# Altium schematic sheet Sheet1.SchDoc
size 406 x 254 mm
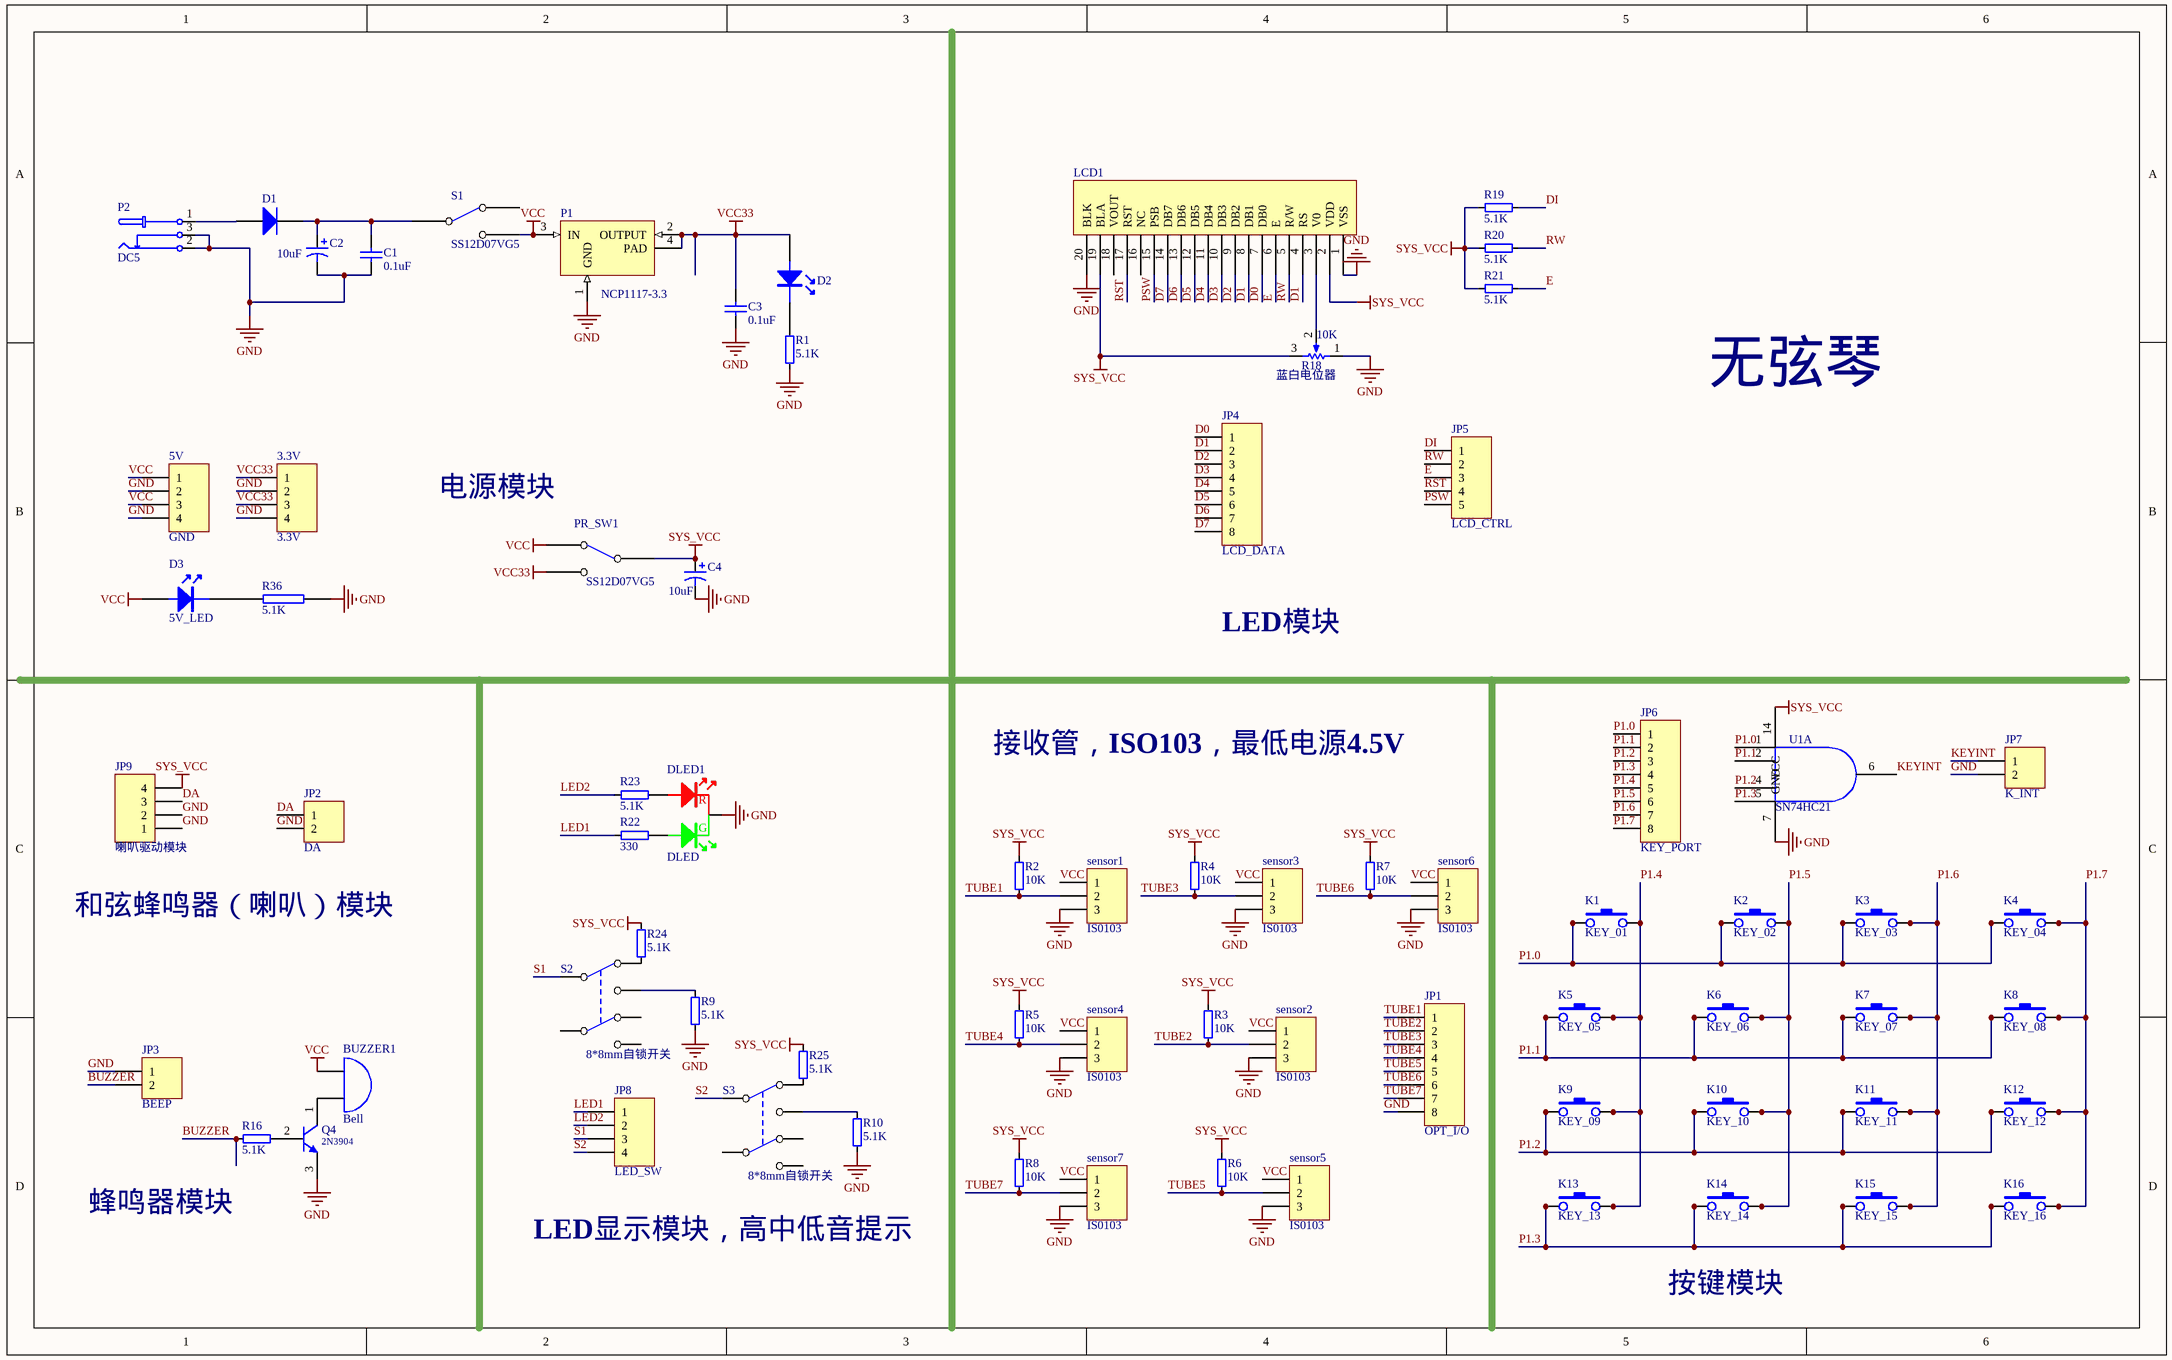
[diagram p0: Sheet1.SchDoc]

## Parts
3.3V  3.3V  [HDR1X4]
5V  GND  [HDR1X4]
BUZZER1  Bell  [BUZZER]
C1  0.1uF  [0805C]
C2  10uF  [1206C]
C3  0.1uF  [0805C]
C4  10uF  [1206C]
D1  1N4147  [DIODE0.3]  (value not drawn)
D2  3.3V_LED  [LED0805]  (value not drawn)
D3  5V_LED  [LED0805]
DLED1  DLED  [DColor LED]
JP1  OPT_I/O  [HDR1X8]
JP2  DA  [HDR1X2]
JP3  BEEP  [HDR1X2]
JP4  LCD_DATA  [HDR1X8]
JP5  LCD_CTRL  [HDR1X5]
JP6  KEY_PORT  [HDR1X8]
JP7  K_INT  [HDR1X2]
JP8  LED_SW  [HDR1X4]
JP9  喇叭驱动模块  [HDR1X4]
K1  KEY_01  [DIP-6X6X5]
K2  KEY_02  [DIP-6X6X5]
K3  KEY_03  [DIP-6X6X5]
K4  KEY_04  [DIP-6X6X5]
K5  KEY_05  [DIP-6X6X5]
K6  KEY_06  [DIP-6X6X5]
K7  KEY_07  [DIP-6X6X5]
K8  KEY_08  [DIP-6X6X5]
K9  KEY_09  [DIP-6X6X5]
K10  KEY_10  [DIP-6X6X5]
K11  KEY_11  [DIP-6X6X5]
K12  KEY_12  [DIP-6X6X5]
K13  KEY_13  [DIP-6X6X5]
K14  KEY_14  [DIP-6X6X5]
K15  KEY_15  [DIP-6X6X5]
K16  KEY_16  [DIP-6X6X5]
LCD1  LCD  [HDR1X20]  (value not drawn)
P1  NCP1117-3.3  [DPAK1]
P2  DC5  [DC-005]
PR_SW1  SS12D07VG5  [SS12D07VG3]
Q4  2N3904  [TO-92A]
R1  5.1K  [0805R]
R2  10K  [0805R]
R3  10K  [0805R]
R4  10K  [0805R]
R5  10K  [0805R]
R6  10K  [0805R]
R7  10K  [0805R]
R8  10K  [0805R]
R9  5.1K  [0805R]
R10  5.1K  [0805R]
R16  5.1K  [0805R]
R18  蓝白电位器  value 10K  [RM065]
R19  5.1K  [0805R]
R20  5.1K  [0805R]
R21  5.1K  [0805R]
R22  330  [0805R]
R23  5.1K  [0805R]
R24  5.1K  [0805R]
R25  5.1K  [0805R]
R36  5.1K  [0805R]
S1  SS12D07VG5  [SS12D07VG3]
S2  8*8mm自锁开关  [KFT DIP-8X8]
S3  8*8mm自锁开关  [KFT DIP-8X8]
sensor1  IS0103  [IS0103]
sensor2  IS0103  [IS0103]
sensor3  IS0103  [IS0103]
sensor4  IS0103  [IS0103]
sensor5  IS0103  [IS0103]
sensor6  IS0103  [IS0103]
sensor7  IS0103  [IS0103]
U1A  SN74HC21  [74HC21D]

## Nets
GND: 3.3V.2 3.3V.4 5V.2 5V.4 C1.1 C2.2 C3.1 C4.2 DLED1.1(C) JP1.8 JP2.2 JP3.1 JP7.2 JP9.1 JP9.2 LCD1.1(VSS) LCD1.20(BLK) P1.1(GND) P2.2 P2.3 Q4.3(E) R1.1 R9.1 R10.1 R18.1(TOP) R36.2 sensor1.3 sensor2.3 sensor3.3 sensor4.3 sensor5.3 sensor6.3 sensor7.3 U1A.7(GND)
SYS_VCC: C4.1 JP9.4 LCD1.2(VDD) LCD1.19(BLA) PR_SW1.2(COMMON) R2.2 R3.2 R4.2 R5.2 R6.2 R7.2 R8.2 R18.3 R19.1 R20.1 R21.1 R24.2 R25.2 U1A.14(VCC)
VCC: 5V.1 5V.3 BUZZER1.1(A) D3.1 P1.3(IN) PR_SW1.1(NC) S1.3(NO) sensor1.1 sensor2.1 sensor3.1 sensor4.1 sensor5.1 sensor6.1 sensor7.1
VCC33: 3.3V.1 3.3V.3 C3.2 D2.1 P1.2(OUTPUT) P1.4(PAD) PR_SW1.3(NO)
BUZZER: JP3.2 R16.1
D0: JP4.1 LCD1.7(DB0)
D1: JP4.2 LCD1.4(RS) LCD1.8(DB1)
D2: JP4.3 LCD1.9(DB2)
D3: JP4.4 LCD1.10(DB3)
D4: JP4.5 LCD1.11(DB4)
D5: JP4.6 LCD1.12(DB5)
D6: JP4.7 LCD1.13(DB6)
D7: JP4.8 LCD1.14(DB7)
DA: JP2.1 JP9.3
DI: JP5.1 R19.2
E: JP5.3 LCD1.6(E) R21.2
KEYINT: JP7.1 U1A.6
LED1: JP8.1 R22.1
LED2: JP8.2 R23.1
P1.0: JP6.1 K1.3 K1.4 K2.3 K2.4 K3.3 K3.4 K4.3 K4.4 U1A.1
P1.1: JP6.2 K5.3 K5.4 K6.3 K6.4 K7.3 K7.4 K8.3 K8.4 U1A.2
P1.2: JP6.3 K9.3 K9.4 K10.3 K10.4 K11.3 K11.4 K12.3 K12.4 U1A.4
P1.3: JP6.4 K13.3 K13.4 K14.3 K14.4 K15.3 K15.4 K16.3 K16.4 U1A.5
P1.4: JP6.5 K1.1 K1.2 K5.1 K5.2 K9.1 K9.2 K13.1 K13.2
P1.5: JP6.6 K2.1 K2.2 K6.1 K6.2 K10.1 K10.2 K14.1 K14.2
P1.6: JP6.7 K3.1 K3.2 K7.1 K7.2 K11.1 K11.2 K15.1 K15.2
P1.7: JP6.8 K4.1 K4.2 K8.1 K8.2 K12.1 K12.2 K16.1 K16.2
PSW: JP5.5 LCD1.15(PSB)
RST: JP5.4 LCD1.17(RST)
RW: JP5.2 LCD1.5(R/W) R20.2
S1: JP8.3 S2.2
S2: JP8.4 S3.2
TUBE1: JP1.1 R2.1 sensor1.2
TUBE2: JP1.2 R3.1 sensor2.2
TUBE3: JP1.3 R4.1 sensor3.2
TUBE4: JP1.4 R5.1 sensor4.2
TUBE5: JP1.5 R6.1 sensor5.2
TUBE6: JP1.6 R7.1 sensor6.2
TUBE7: JP1.7 R8.1 sensor7.2
NetBUZZER1_2: BUZZER1.2(B) Q4.1(C)
NetC1_2: C1.2 C2.1 D1.2(K) S1.2(COMMON)
NetD1_1: D1.1(A) P2.1
NetD2_2: D2.2 R1.2
NetD3_2: D3.2 R36.1
NetDLED1_2: DLED1.2(G) R22.2
NetDLED1_3: DLED1.3(R) R23.2
NetLCD1_3: LCD1.3(V0) R18.2
NetQ4_2: Q4.2(B) R16.2
NetR9_2: R9.2 S2.1
NetR10_2: R10.2 S3.1
NetR24_1: R24.1 S2.3
NetR25_1: R25.1 S3.3

Not connected (* = marked no-connect by the designer): LCD1 16(NC) 18(VOUT); S1 1(NC); S2 4 5 6; S3 4 5 6

## Notes on the sheet
- 无弦琴
- 电源模块
- LED模块
- 接收管，ISO103，最低电源4.5V
- 和弦蜂鸣器（喇叭）模块
- 蜂鸣器模块
- LED显示模块，高中低音提示
- 按键模块

## Library data of the parts
3.3V JP8 JP9 = Header 4: Header, 4-Pin; LatestRevisionDate: 17-Jul-2002; LatestRevisionNote: Re-released for DXP Platform.; Publisher: Altium Limited
5V = Header 4H: Header, 4-Pin, Right Angle; LatestRevisionDate: 17-Jul-2002; LatestRevisionNote: Re-released for DXP Platform.; Publisher: Altium Limited
BUZZER1 = Bell: Electrical Bell; Published: 24-Mar-1999; LatestRevisionDate: 17-Jul-2002; LatestRevisionNote: Re-released for DXP Platform.; PackageReference: PIN2; Publisher: Altium Limited
C1 C3 = Cap: Capacitor; Published: 8-Jun-2000; LatestRevisionDate: 17-Jul-2002; LatestRevisionNote: Re-released for DXP Platform.; PackageReference: RAD-0.3; Publisher: Altium Limited; Value: 0.1uF
C2 C4 = Cap Pol1: Polarized Capacitor (Radial); Published: 8-Jun-2000; LatestRevisionDate: 17-Jul-2002; LatestRevisionNote: Re-released for DXP Platform.; PackageReference: RB7.6-15; Publisher: Altium Limited; Value: 10uF
D1 = Diode 1N4007: 1 Amp General Purpose Rectifier; Published: 8-Jun-2000; LatestRevisionDate: 17-Jul-2002; LatestRevisionNote: Re-released for DXP Platform.; DatasheetDocument: 1998; PackageDocument: Aug-1999; PackageReference: DO-41; Publisher: Altium Limited; Code_JEDEC: DO-204-AL; ComponentLink1Description: Manufacturer Link; ComponentLink1URL: http://www.fairchildsemi.com/; ComponentLink2Description: Datasheet; ComponentLink2URL: http://www.fairchildsemi.com/ds/1N%2F1N4001.pdf
D2 D3 = LED_1
JP1 JP4 JP6 = Header 8: Header, 8-Pin; LatestRevisionDate: 17-Jul-2002; LatestRevisionNote: Re-released for DXP Platform.; Publisher: Altium Limited
JP2 JP3 = Header 2: Header, 2-Pin; LatestRevisionDate: 17-Jul-2002; LatestRevisionNote: Re-released for DXP Platform.; Publisher: Altium Limited
JP5 = Header 5: Header, 5-Pin; LatestRevisionDate: 17-Jul-2002; LatestRevisionNote: Re-released for DXP Platform.; Publisher: Altium Limited
JP7 = Header 2H: Header, 2-Pin, Right Angle; LatestRevisionDate: 17-Jul-2002; LatestRevisionNote: Re-released for DXP Platform.; Publisher: Altium Limited
K1-K16 = KEY: B3F-1055
LCD1 = COMPONENT_1_1
P1 = NCP1117
P2 = DC_Socket: DC-005方口电源插座
PR_SW1 S1 = SW SPDT
Q4 = 2N3904: NPN General Purpose Amplifier; Published: 8-Jun-2000; LatestRevisionDate: 15-Jan-2003; LatestRevisionNote: PCB Footprint 'BCY-W3/D4.7' replaced; DatasheetVersion: 1997; PackageVersion: Sep-1998; PackageReference: TO-92A; Publisher: Altium Limited; Code_JEDEC: TO-92A; ComponentLink1Description: Manufacturer Link; ComponentLink1URL: http://www.fairchildsemi.com/; ComponentLink2Description: Datasheet; ComponentLink2URL: http://www.fairchildsemi.com/ds/2N%2F2N3904.pdf
R1-R10 R16 R19-R25 = R-10K: resistor
R18 = RPot: Potentiometer; Sim Note: Enter the Resistance value and the set point into parameter fields.; Set Position: 0.5; Published: 8-Jun-2000; LatestRevisionDate: 17-Jul-2002; LatestRevisionNote: Re-released for DXP Platform.; PackageReference: VR5; Publisher: Altium Limited; PackageDescription: Variable Resistor, Thru-Hole; 3 Leads
R36 = RES2
S2 S3 = KFT DIP-8X8
sensor1-sensor7 = Header 3: Header, 3-Pin; LatestRevisionDate: 17-Jul-2002; LatestRevisionNote: Re-released for DXP Platform.; Publisher: Altium Limited
U1A = 74HC21